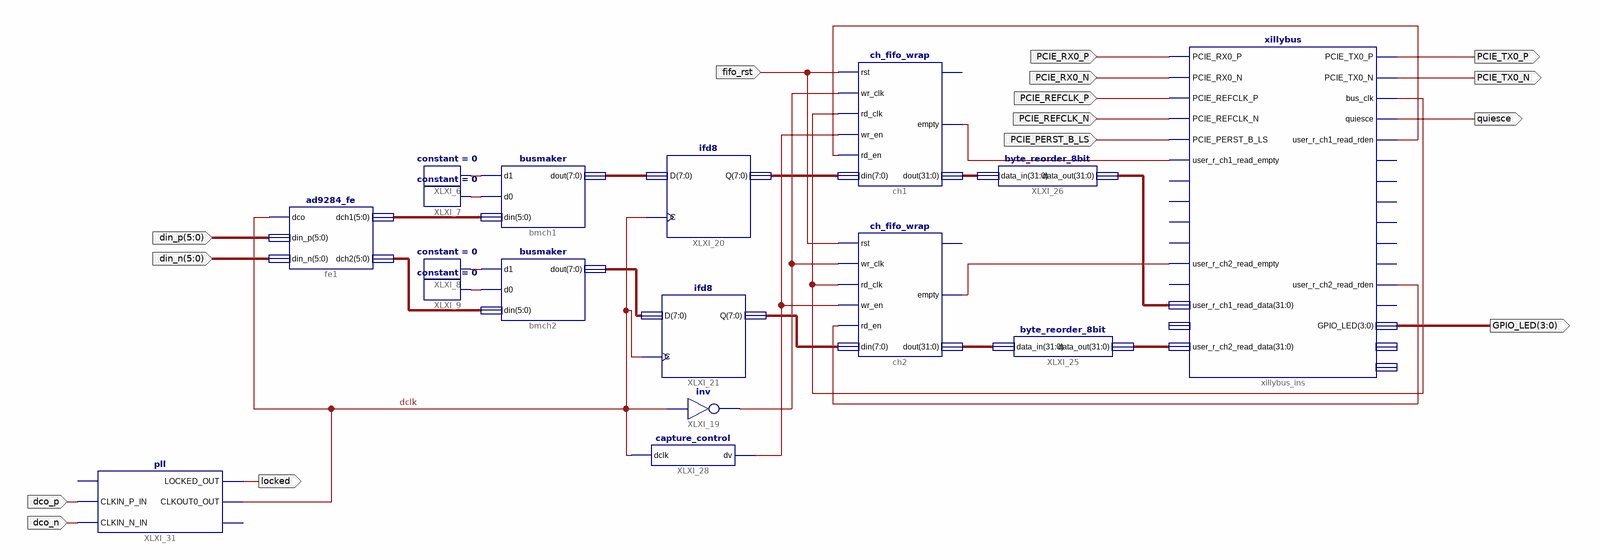
[diagram p0: schematic sheet 1]
// Xilinx ISE schematic capture_2ch_top.sch (virtex5) as structural Verilog: 17 symbols, 15 ports
module capture_2ch_top (
  input  dco_p,
  input  dco_n,
  input  [5:0] din_p,
  input  [5:0] din_n,
  input  fifo_rst,
  input  PCIE_RX0_P,
  input  PCIE_RX0_N,
  input  PCIE_REFCLK_P,
  input  PCIE_REFCLK_N,
  input  PCIE_PERST_B_LS,
  output locked,
  output [3:0] GPIO_LED,
  output PCIE_TX0_P,
  output PCIE_TX0_N,
  output quiesce
);

  wire dclk, XLXN_3, XLXN_4, XLXN_5, XLXN_6, XLXN_30, XLXN_34, XLXN_35, XLXN_36, XLXN_38, XLXN_39, XLXN_58;
  wire [5:0] XLXN_1, XLXN_2;
  wire [7:0] XLXN_21, XLXN_22, XLXN_24, XLXN_25;
  wire [31:0] XLXN_50, XLXN_51, XLXN_52, XLXN_53;

  ad9284_fe fe1 (.dco(dclk), .din_p(din_p), .din_n(din_n), .dch1(XLXN_1), .dch2(XLXN_2));
  busmaker bmch1 (.d1(XLXN_5), .d0(XLXN_6), .din(XLXN_1), .dout(XLXN_21));
  busmaker bmch2 (.d1(XLXN_3), .d0(XLXN_4), .din(XLXN_2), .dout(XLXN_22));
  constant #(.CValue("0")) XLXI_8 (.O(XLXN_3));
  constant #(.CValue("0")) XLXI_9 (.O(XLXN_4));
  constant #(.CValue("0")) XLXI_6 (.O(XLXN_5));
  constant #(.CValue("0")) XLXI_7 (.O(XLXN_6));
  not XLXI_19 (XLXN_30, dclk);
  ifd8 XLXI_20 (.C(dclk), .D(XLXN_21), .Q(XLXN_24));
  ifd8 XLXI_21 (.C(dclk), .D(XLXN_22), .Q(XLXN_25));
  ch_fifo_wrap ch1 (
    .rst(fifo_rst), .wr_clk(XLXN_30), .rd_clk(XLXN_36), .wr_en(XLXN_58), .rd_en(XLXN_38), .din(XLXN_24),
    .empty(XLXN_35), .dout(XLXN_53));  // open: full
  ch_fifo_wrap ch2 (
    .rst(fifo_rst), .wr_clk(XLXN_30), .rd_clk(XLXN_36), .wr_en(XLXN_58), .rd_en(XLXN_39), .din(XLXN_25),
    .empty(XLXN_34), .dout(XLXN_52));  // open: full
  xillybus xillybus_ins (
    .PCIE_RX0_P(PCIE_RX0_P), .PCIE_RX0_N(PCIE_RX0_N), .PCIE_REFCLK_P(PCIE_REFCLK_P),
    .PCIE_REFCLK_N(PCIE_REFCLK_N), .PCIE_PERST_B_LS(PCIE_PERST_B_LS), .user_r_ch1_read_empty(XLXN_35),
    .user_r_ch2_read_empty(XLXN_34), .user_r_ch1_read_data(XLXN_50), .user_r_ch2_read_data(XLXN_51),
    .PCIE_TX0_P(PCIE_TX0_P), .PCIE_TX0_N(PCIE_TX0_N), .bus_clk(XLXN_36), .quiesce(quiesce),
    .user_r_ch1_read_rden(XLXN_38), .user_r_ch2_read_rden(XLXN_39), .GPIO_LED(GPIO_LED));  // open: user_r_ch1_read_eof, user_r_mem_8_empty, user_r_mem_8_eof, user_w_mem_8_full, user_r_ch2_read_eof, user_r_mem_8_data, user_r_ch1_read_open, user_r_mem_8_rden, user_r_mem_8_open, user_w_mem_8_wren, user_w_mem_8_open, user_mem_8_addr_update, user_r_ch2_read_open, user_w_mem_8_data, user_mem_8_addr
  byte_reorder_8bit XLXI_25 (.data_in(XLXN_52), .data_out(XLXN_51));
  byte_reorder_8bit XLXI_26 (.data_in(XLXN_53), .data_out(XLXN_50));
  capture_control XLXI_28 (.dclk(dclk), .dv(XLXN_58));
  pll XLXI_31 (
    .CLKIN_P_IN(dco_p), .CLKIN_N_IN(dco_n), .LOCKED_OUT(locked), .CLKOUT0_OUT(dclk));  // open: RST_IN, CLKIN_IBUFGDS_OUT
endmodule
